# Altium schematic sheet LEDS.SchDoc
size 199 x 149 mm; SheetNumber: 3; SheetTotal: 13
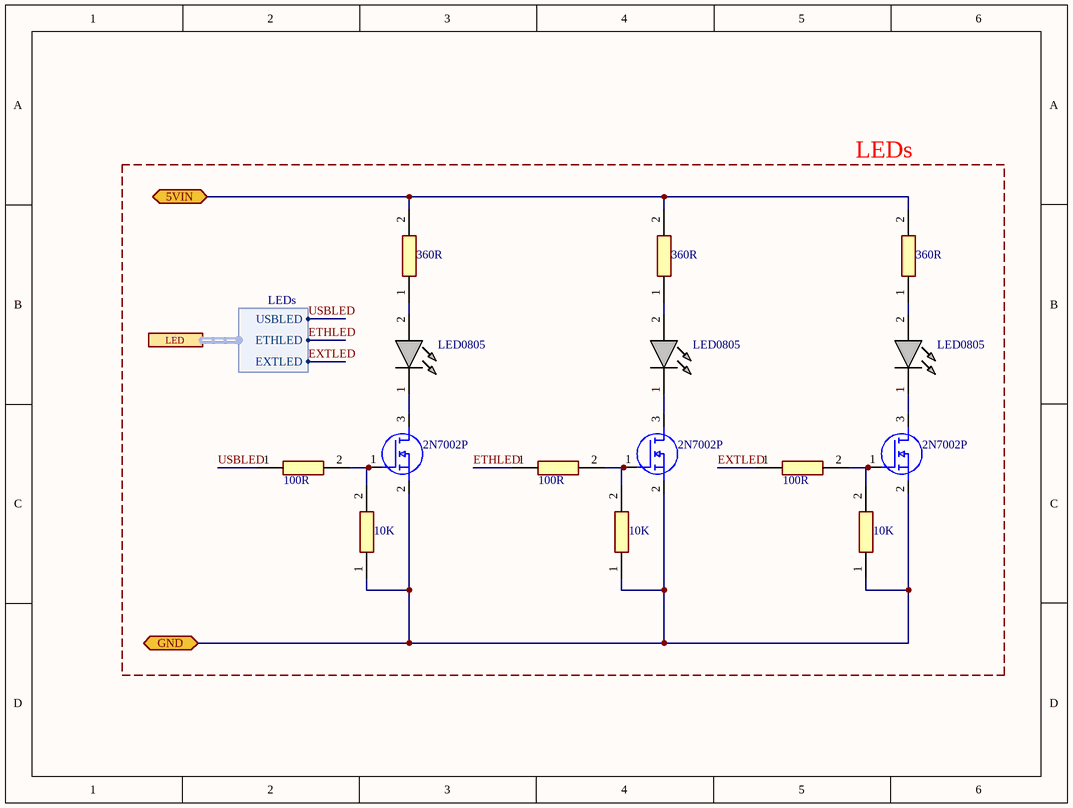
[diagram p0: LEDS.SchDoc]

## Parts
LEDETH(BLUE)  LED0805  [LED0805]
LEDEXT(YELLOW)  LED0805  [LED0805]
LEDUSB(BLUE)  LED0805  [LED0805]
NMOSETH  2N7002P  [2N7002P]
NMOSEXT  2N7002P  [2N7002P]
NMOSUSB  2N7002P  [2N7002P]
RESETH  360R  [RES0805]
RESEXT  360R  [RES0805]
RESG1  100R  [RES0805]
RESG2  10K  [RES0805]
RESG3  100R  [RES0805]
RESG4  10K  [RES0805]
RESG5  100R  [RES0805]
RESG6  10K  [RES0805]
RESUSB  360R  [RES0805]

## Blocks framed on the sheet
LEDs: LEDETH(BLUE) LEDEXT(YELLOW) LEDUSB(BLUE) NMOSETH NMOSEXT NMOSUSB RESETH RESEXT RESG1-RESG6 RESUSB

## Ports
5VIN (bidir, see CONTROL_PCB_MAIN[4B], ADC1[2B], I2C[2A], I_O[1A], MOTORS[2B], RELAY_5V_3.3V_LEVEL[3B], SPI[1A], UARTSTM[2A]), GND (bidir, see CONTROL_PCB_MAIN[4B], ADC1[2D], CAN[2C], I2C[2D], I_O[1C], MOTORS[2D], RELAY_5V_3.3V_LEVEL[5C], RELAY_12VV_VDD_LEVEL[5B], SPI[1D], STM32[1D], UARTSTM[2D]), LED (harness LEDs, see CONTROL_PCB_MAIN[4B], STM32[5B])

## Harnesses
LEDs: USBLED, ETHLED, EXTLED

## Nets
5VIN: RESETH.2 RESEXT.2 RESUSB.2 ; port 5VIN
ETHLED: RESG3.1 ; port LED.ETHLED
EXTLED: RESG5.1 ; port LED.EXTLED
GND: NMOSETH.2(S) NMOSEXT.2(S) NMOSUSB.2(S) RESG2.1 RESG4.1 RESG6.1 ; port GND
USBLED: RESG1.1 ; port LED.USBLED
NetLEDETH(BLUE)_1: LEDETH(BLUE).1(K) NMOSETH.3(D)
NetLEDETH(BLUE)_2: LEDETH(BLUE).2(A) RESETH.1
NetLEDEXT(YELLOW)_1: LEDEXT(YELLOW).1(K) NMOSEXT.3(D)
NetLEDEXT(YELLOW)_2: LEDEXT(YELLOW).2(A) RESEXT.1
NetLEDUSB(BLUE)_1: LEDUSB(BLUE).1(K) NMOSUSB.3(D)
NetLEDUSB(BLUE)_2: LEDUSB(BLUE).2(A) RESUSB.1
NetNMOSETH_1: NMOSETH.1(G) RESG3.2 RESG4.2
NetNMOSEXT_1: NMOSEXT.1(G) RESG5.2 RESG6.2
NetNMOSUSB_1: NMOSUSB.1(G) RESG1.2 RESG2.2

## Library data of the parts
LEDETH(BLUE) LEDEXT(YELLOW) LEDUSB(BLUE) = LED0805: LED-SMD0805
NMOSETH NMOSEXT NMOSUSB = 2N7002P: 2N7002P,215
RESETH RESEXT RESG1-RESG6 RESUSB = RES0805: RES-SMD0805